# Altium project DataLogger.PrjPcb
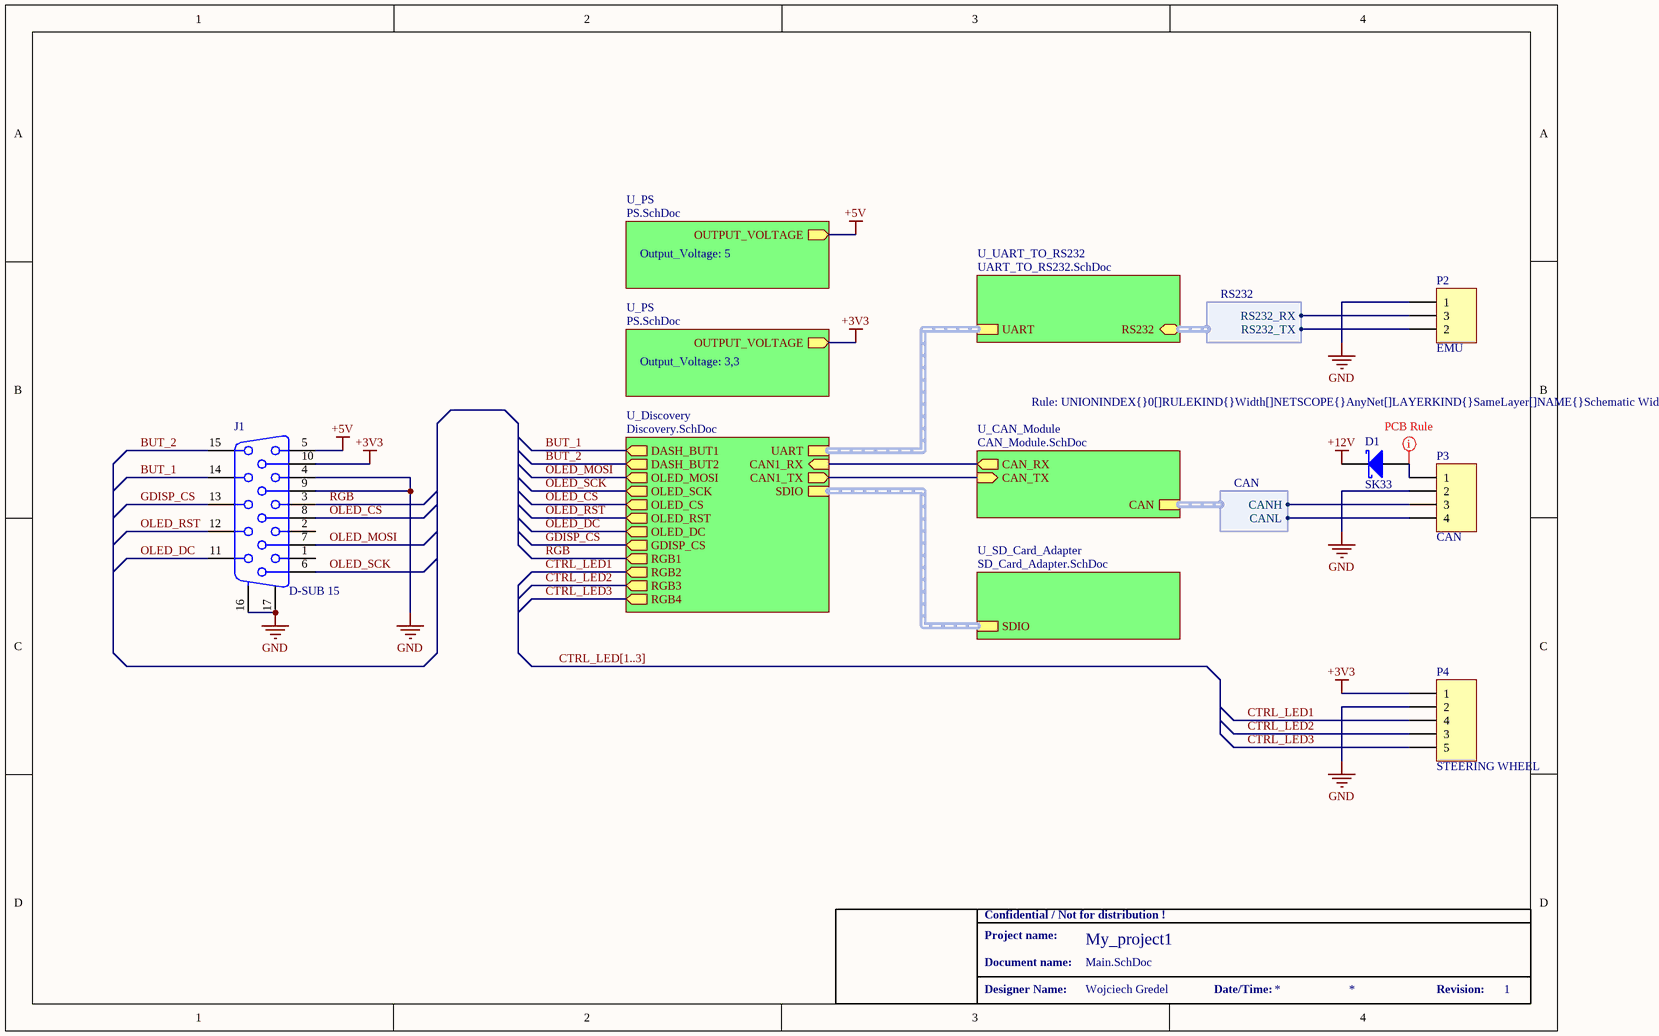
[diagram p0: Main.SchDoc]
4 sheets, 28 parts. Net scope: hierarchical (ports join the sheet entries above them; power ports are global).
Board files: PCB1.PcbDoc, PCB2_homemade.PcbDoc
Sheets:
  Main.SchDoc
    U_CAN_Module = CAN_Module.SchDoc
    U_SD_Card_Adapter = SD_Card_Adapter.SchDoc
    U_Discovery = Discovery.SchDoc

## Sheet Main.SchDoc
size A4; Author: Wojciech Gredel; CompanyName: AGH UST; Revision: 1; ProjectName: My_project1

### Parts
D1  SK33  [DO214AB_IPC_MD]
J1  D-SUB 15  [Dsub-3H15]
P2  EMU  [HDR_1x3_3_94_LOCKING]
P3  CAN  [HDR_1x4_3_94_LOCKING]
P4  STEERING WHEEL  [HDR_1x5_3_94_LOCKING]

### Sub-sheets
U_CAN_Module = CAN_Module.SchDoc: CAN (harness CAN), CAN_RX (out), CAN_TX (in)
U_Discovery = Discovery.SchDoc: UART (harness UART), SDIO (harness SDIO), DASH_BUT2 (out), OLED_MOSI (out), DASH_BUT1 (out), OLED_SCK (out), OLED_CS (out), OLED_RST (out), OLED_DC (out), GDISP_CS (out), CAN1_RX (in), CAN1_TX (out), RGB1 (out), RGB2 (out), RGB3 (out), RGB4 (out)
U_PS = PS.SchDoc (file not in this document): OUTPUT_VOLTAGE (out)  | Output_Voltage: 5
U_PS = PS.SchDoc (file not in this document): OUTPUT_VOLTAGE (out)  | Output_Voltage: 3,3
U_SD_Card_Adapter = SD_Card_Adapter.SchDoc: SDIO (harness SDIO)
U_UART_TO_RS232 = UART_TO_RS232.SchDoc (file not in this document): UART (harness UART), RS232 (harness RS232)

### Harnesses
CAN: CANH, CANL
RS232: RS232_RX, RS232_TX

### Nets
+3V3: J1.10 P4.1 ; sheet U_PS/OUTPUT_VOLTAGE
+5V: J1.5 ; sheet U_PS/OUTPUT_VOLTAGE
+12V: D1.2(K)
GND: J1.4 J1.9 J1.16(MH1) J1.17(MH2) P2.1 P3.2 P4.2
BUT_1: J1.14 ; sheet U_Discovery/DASH_BUT1
BUT_2: J1.15 ; sheet U_Discovery/DASH_BUT2
CAN1_RX: sheet U_CAN_Module/CAN_RX, sheet U_Discovery/CAN1_RX
CAN1_TX: sheet U_CAN_Module/CAN_TX, sheet U_Discovery/CAN1_TX
CANH: P3.3 ; sheet U_CAN_Module/CAN.CANH
CANL: P3.4 ; sheet U_CAN_Module/CAN.CANL
CTRL_LED1: P4.4 ; sheet U_Discovery/RGB2
CTRL_LED2: P4.3 ; sheet U_Discovery/RGB3
CTRL_LED3: P4.5 ; sheet U_Discovery/RGB4
GDISP_CS: J1.13 ; sheet U_Discovery/GDISP_CS
OLED_CS: J1.8 ; sheet U_Discovery/OLED_CS
OLED_DC: J1.11 ; sheet U_Discovery/OLED_DC
OLED_MOSI: J1.7 ; sheet U_Discovery/OLED_MOSI
OLED_RST: J1.12 ; sheet U_Discovery/OLED_RST
OLED_SCK: J1.6 ; sheet U_Discovery/OLED_SCK
RGB: J1.3 ; sheet U_Discovery/RGB1
NetD1_1: D1.1(A) P3.1
NetP2_2: P2.2 ; sheet U_UART_TO_RS232/RS232.RS232_TX
NetP2_3: P2.3 ; sheet U_UART_TO_RS232/RS232.RS232_RX

Not connected (* = marked no-connect by the designer): J1 1 2

### Buses and harness runs
bus CTRL_LED[1..3]
harness sheet U_Discovery/SDIO = sheet U_SD_Card_Adapter/SDIO
harness sheet U_Discovery/UART = sheet U_UART_TO_RS232/UART

### Layout directives
rule Width Constraint [Pref Width = 25mil    Min Width = 20mil    Max Width = 30mil]: NetD1_1

### Notes on the sheet
- Confidential / Not for distribution !
- Project name:
- Document name:
- Designer Name:
- Date/Time:
- Revision:

### Library data of the parts
D1 = SK33: Schottky Diode; Manufacturer: Diotec; ManufacturerURL: http://diotec.com/tl_files/diotec/files/pdf/datasheets/sk32; Supplier: TME; Supplier Part Number: SK33-DIO
J1 = D-SUB 15: Receptacle Assembly, 15-Pin, Sim Line Connector; Manufacturer: TE Connectivity; PackageDocument: B; Positions: 15; Gender: Receptacle Header; Published: 15-Jun-2001; LatestRevisionDate: 17-Jul-2002; LatestRevisionNote: Re-released for DXP Platform.; DatasheetDocument: 24-Nov-1999; PackageReference: 788574; Publisher: Altium Limited; Orientation: Right Angle; Supplier: TME; Supplier Part Number: 1-1734530-3
P2 = MHDR1X3: ST1212 3 pin waterproof connector; Manufacturer: Joint Tech; LatestRevisionDate: 17-Jul-2002; LatestRevisionNote: Re-released for DXP Platform.; Publisher: Altium Limited; Supplier: TME; Supplier Part Number: A3960WV-03P
P3 = Header 4: Header, 4-Pin; Manufacturer: Joint Tech; LatestRevisionDate: 17-Jul-2002; LatestRevisionNote: Re-released for DXP Platform.; Publisher: Altium Limited; Supplier: TME; Supplier Part Number: A3960WV-04P
P4 = Header 5: Header, 5-Pin; Manufacturer: Joint Tech; LatestRevisionDate: 17-Jul-2002; LatestRevisionNote: Re-released for DXP Platform.; Publisher: Altium Limited; Supplier: TME; Supplier Part Number: A3960WV-05P

## Sheet CAN_Module.SchDoc
size A4; Author: Wojciech Grędel; Revision: 1
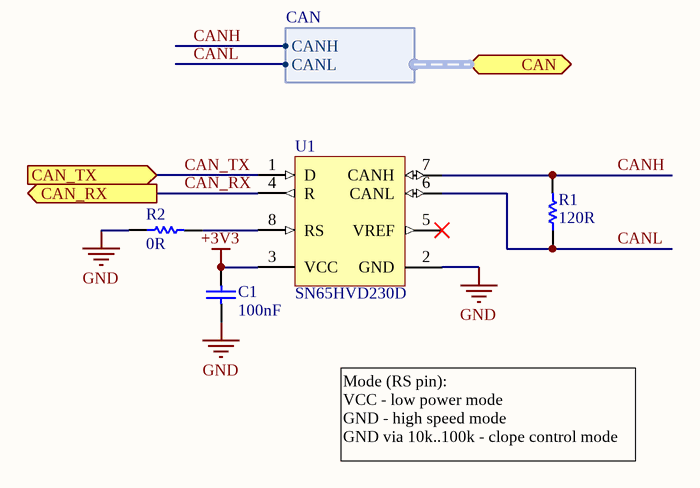
[diagram p1: CAN_Module.SchDoc]

### Parts
C1  value 100nF  [CAP_0805_IPC_MD]  (hidden comment: Cap)
R1  value 120R  [RES_1206_IPC_MD]  (hidden comment: Res)
R2  value 0R  [RES_0805_IPC_MD]  (hidden comment: Res)
U1  SN65HVD230D  [SOIC_8_IPC_MD]

### Ports
CAN (harness CAN), CAN_RX (out), CAN_TX (in)

### Harnesses
CAN: CANH, CANL

### Nets
+3V3: C1.2 U1.3(VCC)
GND: C1.1 R2.1 U1.2(GND)
CAN_RX: U1.4(R) ; port CAN_RX  [project net CAN1_RX]
CAN_TX: U1.1(D) ; port CAN_TX  [project net CAN1_TX]
CANH: R1.2 U1.7(CANH) ; port CAN.CANH
CANL: R1.1 U1.6(CANL) ; port CAN.CANL
NetR2_2: R2.2 U1.8(RS)

Not connected (* = marked no-connect by the designer): U1 5(VREF)*

### Notes on the sheet
- Mode (RS pin):
  VCC - low power mode
  GND - high speed mode
  GND via 10k..100k - clope control mode
- Confidential / Not for distribution !
- Project name:
- Document name:
- Designer Name:
- Date/Time:
- Revision:

### Library data of the parts
C1 = Cap: Capacitor; Manufacturer: Samsung; Supplier Part Number: CL21B104KBCNNNC; Supplier: TME
R1 R2 = Res: Resistor; Supplier: *; Supplier Part Number: *; Manufacturer: *
U1 = SN65HVD230DR: 3.3V CAN Transceiver with Standby Mode, 17 mA, -40 to 85 degC, 8-pin SOIC (D), Green (RoHS & no Sb/Br); Manufacturer: Texas Instruments; Drivers Per Package: 1; Transient Pulse Protection(V): -25 to 25; ICC(Max)(mA): 17; Supply Voltage(s)(V): 3.3; Rating: Catalog; DatasheetVersion: SLOS346K; PackageVersion: revM, Jun-2011; PackageReference: D8; PackageDescription: 8-Pin Plastic Small Outline Integrated Circuit, 4.9 x 3.9 mm, Pitch 1.27 mm Pitch; Supplier 1: Digi-Key; Supplier Part Number 1: 296-11654-2-ND; Supplier 2: Digi-Key; Supplier Part Number 2: 296-11654-1-ND; Supplier 3: Digi-Key; Supplier Part Number 3: 296-11654-6-ND; Supplier 4: Farnell; Supplier Part Number 4: 8452148RL; Supplier 5: Farnell; Supplier Part Number 5: 8452148; Supplier 6: Newark; Supplier Part Number 6: 75C7745; Supplier 7: Mouser; Supplier Part Number 7: 595-SN65HVD230DR; Eco-Plan: Green (RoHS & no Sb/Br); SubFamily: CAN; Receivers Per Package: 1; Isolated: No; Low Power Mode: Standby; Footprint: PCA82C250; Mounting Technology: Surface Mount; PartNumber: SN65HVD230DR; Code_JEDEC: MS-012AA; ComponentLink1Description: Datasheet; ComponentLink1URL: http://www.ti.com/general/docs/lit/getliterature.tsp?genericPartNumber=SN65HVD230&fileType=pdf; Supplier Part Number: SN65HVD230D; Supplier: TME

## Sheet SD_Card_Adapter.SchDoc
size A4; Author: Wojciech Grędel; Revision: 1
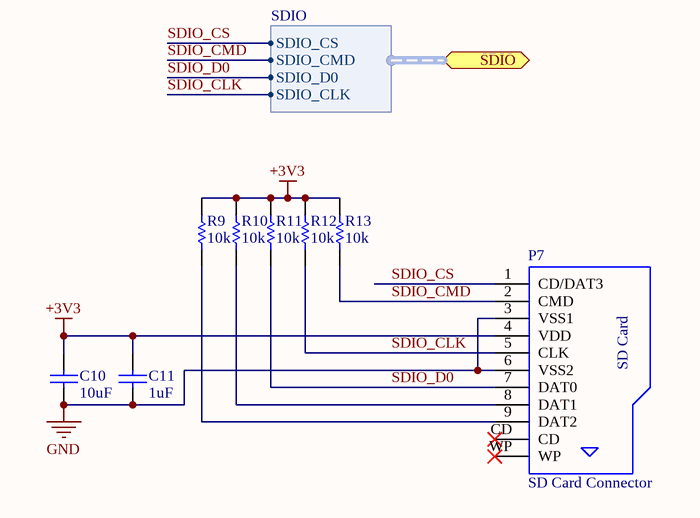
[diagram p2: SD_Card_Adapter.SchDoc]

### Parts
C10  value 10uF  [CAP_0805_IPC_MD]  (hidden comment: Cap)
C11  value 1uF  [CAP_0805_IPC_MD]  (hidden comment: Cap)
P7  SD Card Connector  [693061010911]
R9  value 10k  [RES_0805_IPC_MD]  (hidden comment: Res)
R10  value 10k  [RES_0805_IPC_MD]  (hidden comment: Res)
R11  value 10k  [RES_0805_IPC_MD]  (hidden comment: Res)
R12  value 10k  [RES_0805_IPC_MD]  (hidden comment: Res)
R13  value 10k  [RES_0805_IPC_MD]  (hidden comment: Res)

### Ports
SDIO (harness SDIO)

### Harnesses
SDIO: SDIO_CS, SDIO_CMD, SDIO_D0, SDIO_CLK

### Nets
+3V3: C10.2 C11.2 P7.4(VDD) R9.2 R10.2 R11.2 R12.2 R13.2
GND: C10.1 C11.1 P7.3(VSS1) P7.6(VSS2)
SDIO_CLK: P7.5(CLK) R12.1 ; port SDIO.SDIO_CLK
SDIO_CMD: P7.2(CMD) R13.1 ; port SDIO.SDIO_CMD
SDIO_CS: P7.1(CD/DAT3) ; port SDIO.SDIO_CS
SDIO_D0: P7.7(DAT0) R11.1 ; port SDIO.SDIO_D0
NetP7_8: P7.8(DAT1) R10.1
NetP7_9: P7.9(DAT2) R9.1

Not connected (* = marked no-connect by the designer): P7 CD* WP*

### Notes on the sheet
- (in symbol SD Card Connector) SD Card

### Library data of the parts
C10 = Cap: Capacitor; Manufacturer: Sansung; Supplier Part Number: CL21A106KOQNNNF; Supplier: TME
C11 = Cap: Capacitor; Manufacturer: Samsung; Supplier Part Number: CL21B105KOFNNNF; Supplier: TME
P7 = SD Card Connector: WR-CRD SD_Push and Push; Manufacturer: W¨ąrth Elektronik eiSos GmbH; Manufacturer: Adam Tech; ComponentLink1 Description: Manufacturer; ComponentLink2 Description: Datasheet; NoPins: 11; ComponentLink1URL: http://www.we-online.de; ComponentLink2URL: http://katalog.we-online.de/em/datasheet/693061010911.pdf; Created by: Karrer Zheng; Created Date: 10/10/2014; partNo: 693061010911; Supplier: TME; Supplier Part Number: SDP-09M-SG
R9-R13 = Res: Resistor; Supplier: *; Supplier Part Number: *; Manufacturer: *

## Sheet Discovery.SchDoc
size A4; Author: Wojciech Grędel; Revision: 1
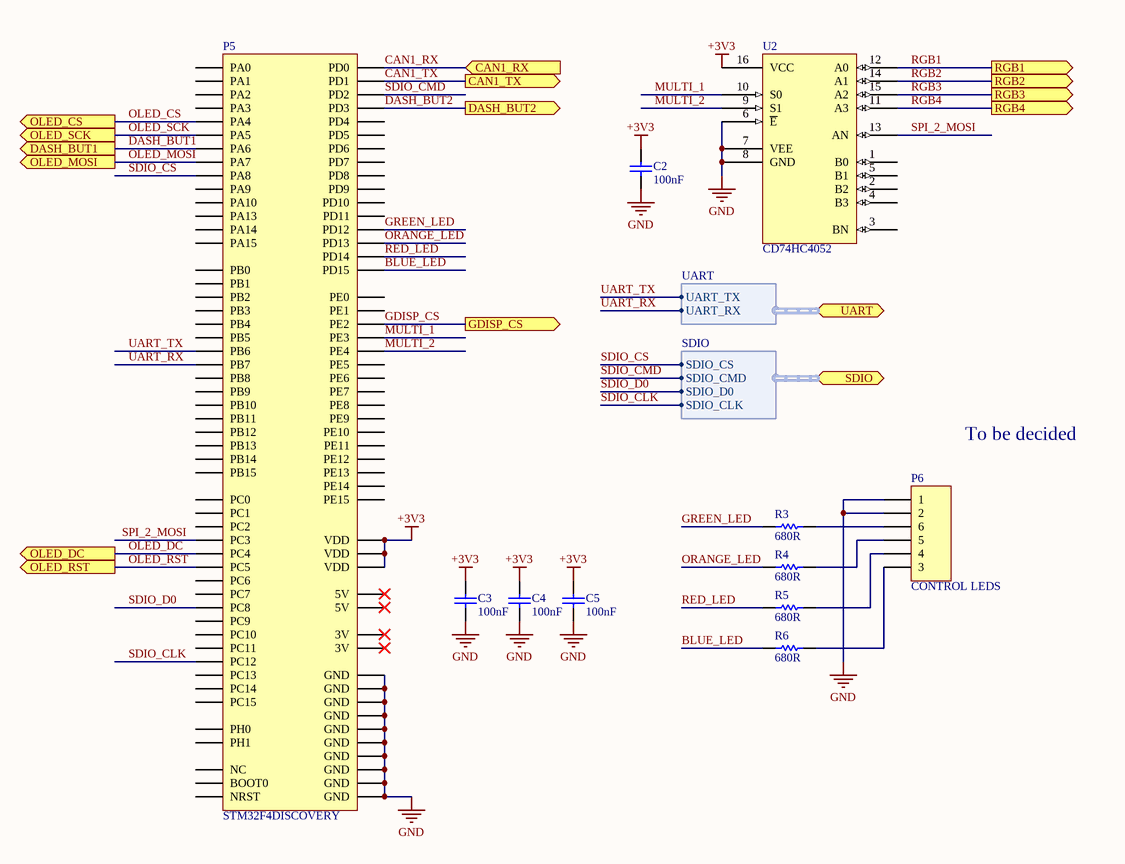
[diagram p3: Discovery.SchDoc]

### Parts
C2  value 100nF  [CAP_0805_IPC_MD]  (hidden comment: Cap)
C3  value 100nF  [CAP_0805_IPC_MD]  (hidden comment: Cap)
C4  value 100nF  [CAP_0805_IPC_MD]  (hidden comment: Cap)
C5  value 100nF  [CAP_0805_IPC_MD]  (hidden comment: Cap)
P5  STM32F4DISCOVERY  [DISCOVERY_F4]
P6  CONTROL LEDS  [HDR_1x6_3_94_LOCKING]
R3  value 680R  [RES_0805_IPC_MD]  (hidden comment: Res)
R4  value 680R  [RES_0805_IPC_MD]  (hidden comment: Res)
R5  value 680R  [RES_0805_IPC_MD]  (hidden comment: Res)
R6  value 680R  [RES_0805_IPC_MD]  (hidden comment: Res)
U2  CD74HC4052  [SO_16_IPC_MD]

### Ports
CAN1_RX (in), CAN1_TX (out), DASH_BUT1 (out), DASH_BUT2 (out), GDISP_CS (out), OLED_CS (out), OLED_DC (out), OLED_MOSI (out), OLED_RST (out), OLED_SCK (out), RGB1 (out), RGB2 (out), RGB3 (out), RGB4 (out), SDIO (harness SDIO), UART (harness UART)

### Harnesses
UART: UART_TX, UART_RX
SDIO: SDIO_CS, SDIO_CMD, SDIO_D0, SDIO_CLK

### Nets
+3V3: C2.2 C3.2 C4.2 C5.2 P5.3(VDD) P5.4(VDD) P5.72(VDD) U2.16(VCC)
GND: C2.1 C3.1 C4.1 C5.1 P5.1(GND) P5.2(GND) P5.5(GND) P5.23(GND) P5.49(GND) P5.50(GND) P5.51(GND) P5.52(GND) P5.99(GND) P5.100(GND) P6.1 P6.2 U2.6(~{E}) U2.7(VEE) U2.8(GND)
BLUE_LED: P5.47(PD15) R6.1
CAN1_RX: P5.86(PD0) ; port CAN1_RX
CAN1_TX: P5.83(PD1) ; port CAN1_TX
DASH_BUT1: P5.18(PA6) ; port DASH_BUT1  [project net BUT_1]
DASH_BUT2: P5.81(PD3) ; port DASH_BUT2  [project net BUT_2]
GDISP_CS: P5.65(PE2) ; port GDISP_CS
GREEN_LED: P5.44(PD12) R3.1
MULTI_1: P5.66(PE3) U2.10(S0)
MULTI_2: P5.63(PE4) U2.9(S1)
OLED_CS: P5.16(PA4) ; port OLED_CS
OLED_DC: P5.20(PC4) ; port OLED_DC
OLED_MOSI: P5.17(PA7) ; port OLED_MOSI
OLED_RST: P5.19(PC5) ; port OLED_RST
OLED_SCK: P5.15(PA5) ; port OLED_SCK
ORANGE_LED: P5.45(PD13) R4.1
RED_LED: P5.46(PD14) R5.1
RGB1: U2.12(A0) ; port RGB1  [project net RGB]
RGB2: U2.14(A1) ; port RGB2  [project net CTRL_LED1]
RGB3: U2.15(A2) ; port RGB3  [project net CTRL_LED2]
RGB4: U2.11(A3) ; port RGB4  [project net CTRL_LED3]
SDIO_CLK: P5.85(PC12) ; port SDIO.SDIO_CLK
SDIO_CMD: P5.84(PD2) ; port SDIO.SDIO_CMD
SDIO_CS: P5.93(PA8) ; port SDIO.SDIO_CS
SDIO_D0: P5.95(PC8) ; port SDIO.SDIO_D0
SPI_2_MOSI: P5.9(PC3) U2.13(AN)
UART_RX: P5.74(PB7) ; port UART.UART_RX
UART_TX: P5.73(PB6) ; port UART.UART_TX
NetP6_3: P6.3 R6.2
NetP6_4: P6.4 R5.2
NetP6_5: P6.5 R4.2
NetP6_6: P6.6 R3.2

Not connected (* = marked no-connect by the designer): P5 6(NRST) 7(PC1) 8(PC0) 10(PC2) 11(PA1) 12(PA0) 13(PA3) 14(PA2) 21(PB1) 22(PB0) 24(PB2) 25(PE7) 26(PE8) 27(PE9) 28(PE10) 29(PE11) 30(PE12) 31(PE13) 32(PE14) 33(PE15) 34(PB10) 35(PB11) 36(PB12) 37(PB13) 38(PB14) 39(PB15) 40(PD8) 41(PD9) 42(PD10) 43(PD11) 48(NC) 53(5V)* 54(5V)* 55(3V)* 56(3V)* 57(PH0) 58(PH1) 59(PC14) 60(PC15) 61(PE6) 62(PC13) 64(PE5) 67(PE0) 68(PE1) 69(PB8) 70(PB9) 71(BOOT0) 75(PB4) 76(PB5) 77(PD7) 78(PB3) 79(PD5) 80(PD6) 82(PD4) 87(PC10) 88(PC11) 89(PA14) 90(PA15) 91(PA10) 92(PA13) 94(PA9) 96(PC9) 97(PC6) 98(PC7); U2 1(B0) 2(B2) 3(BN) 4(B3) 5(B1)

### Notes on the sheet
- To be decided
- Confidential / Not for distribution !
- Project name:
- Document name:
- Designer Name:
- Date/Time:
- Revision:

### Library data of the parts
C2-C5 = Cap: Capacitor; Manufacturer: Samsung; Supplier Part Number: CL21B104KBCNNNC; Supplier: TME
P5 = STM32F4DISCOVERY: STM32F4DISCOVERY connector for shield; LatestRevisionDate: 16-Apr-2016; Publisher: Wojciech Grędel
P6 = Header 6: Header, 6-Pin; Manufacturer: Joint Tech; LatestRevisionDate: 17-Jul-2002; LatestRevisionNote: Re-released for DXP Platform.; Publisher: Altium Limited; Supplier: TME; Supplier Part Number: A3960WV-06P
R3-R6 = Res: Resistor; Supplier: *; Supplier Part Number: *; Manufacturer: *
U2 = CD74HC4052: MUX/DEMUX; Supplier: *; Manufacturer: *; Supplier Part Number: *

## Nets that join several sheets
+3V3: Main (J1.10 P4.1), CAN_Module (C1.2 U1.3), SD_Card_Adapter (8 pins), Discovery (8 pins)
GND: Main (7 pins), CAN_Module (C1.1 R2.1 U1.2), SD_Card_Adapter (C10.1 C11.1 P7.3 P7.6), Discovery (19 pins)
BUT_1: Main (J1.14), Discovery (P5.18)
BUT_2: Main (J1.15), Discovery (P5.81)
CAN1_RX: CAN_Module (U1.4), Discovery (P5.86)
CAN1_TX: CAN_Module (U1.1), Discovery (P5.83)
CANH: Main (P3.3), CAN_Module (R1.2 U1.7)
CANL: Main (P3.4), CAN_Module (R1.1 U1.6)
CTRL_LED1: Main (P4.4), Discovery (U2.14)
CTRL_LED2: Main (P4.3), Discovery (U2.15)
CTRL_LED3: Main (P4.5), Discovery (U2.11)
GDISP_CS: Main (J1.13), Discovery (P5.65)
OLED_CS: Main (J1.8), Discovery (P5.16)
OLED_DC: Main (J1.11), Discovery (P5.20)
OLED_MOSI: Main (J1.7), Discovery (P5.17)
OLED_RST: Main (J1.12), Discovery (P5.19)
OLED_SCK: Main (J1.6), Discovery (P5.15)
RGB: Main (J1.3), Discovery (U2.12)
SDIO_CLK: SD_Card_Adapter (P7.5 R12.1), Discovery (P5.85)
SDIO_CMD: SD_Card_Adapter (P7.2 R13.1), Discovery (P5.84)
SDIO_CS: SD_Card_Adapter (P7.1), Discovery (P5.93)
SDIO_D0: SD_Card_Adapter (P7.7 R11.1), Discovery (P5.95)